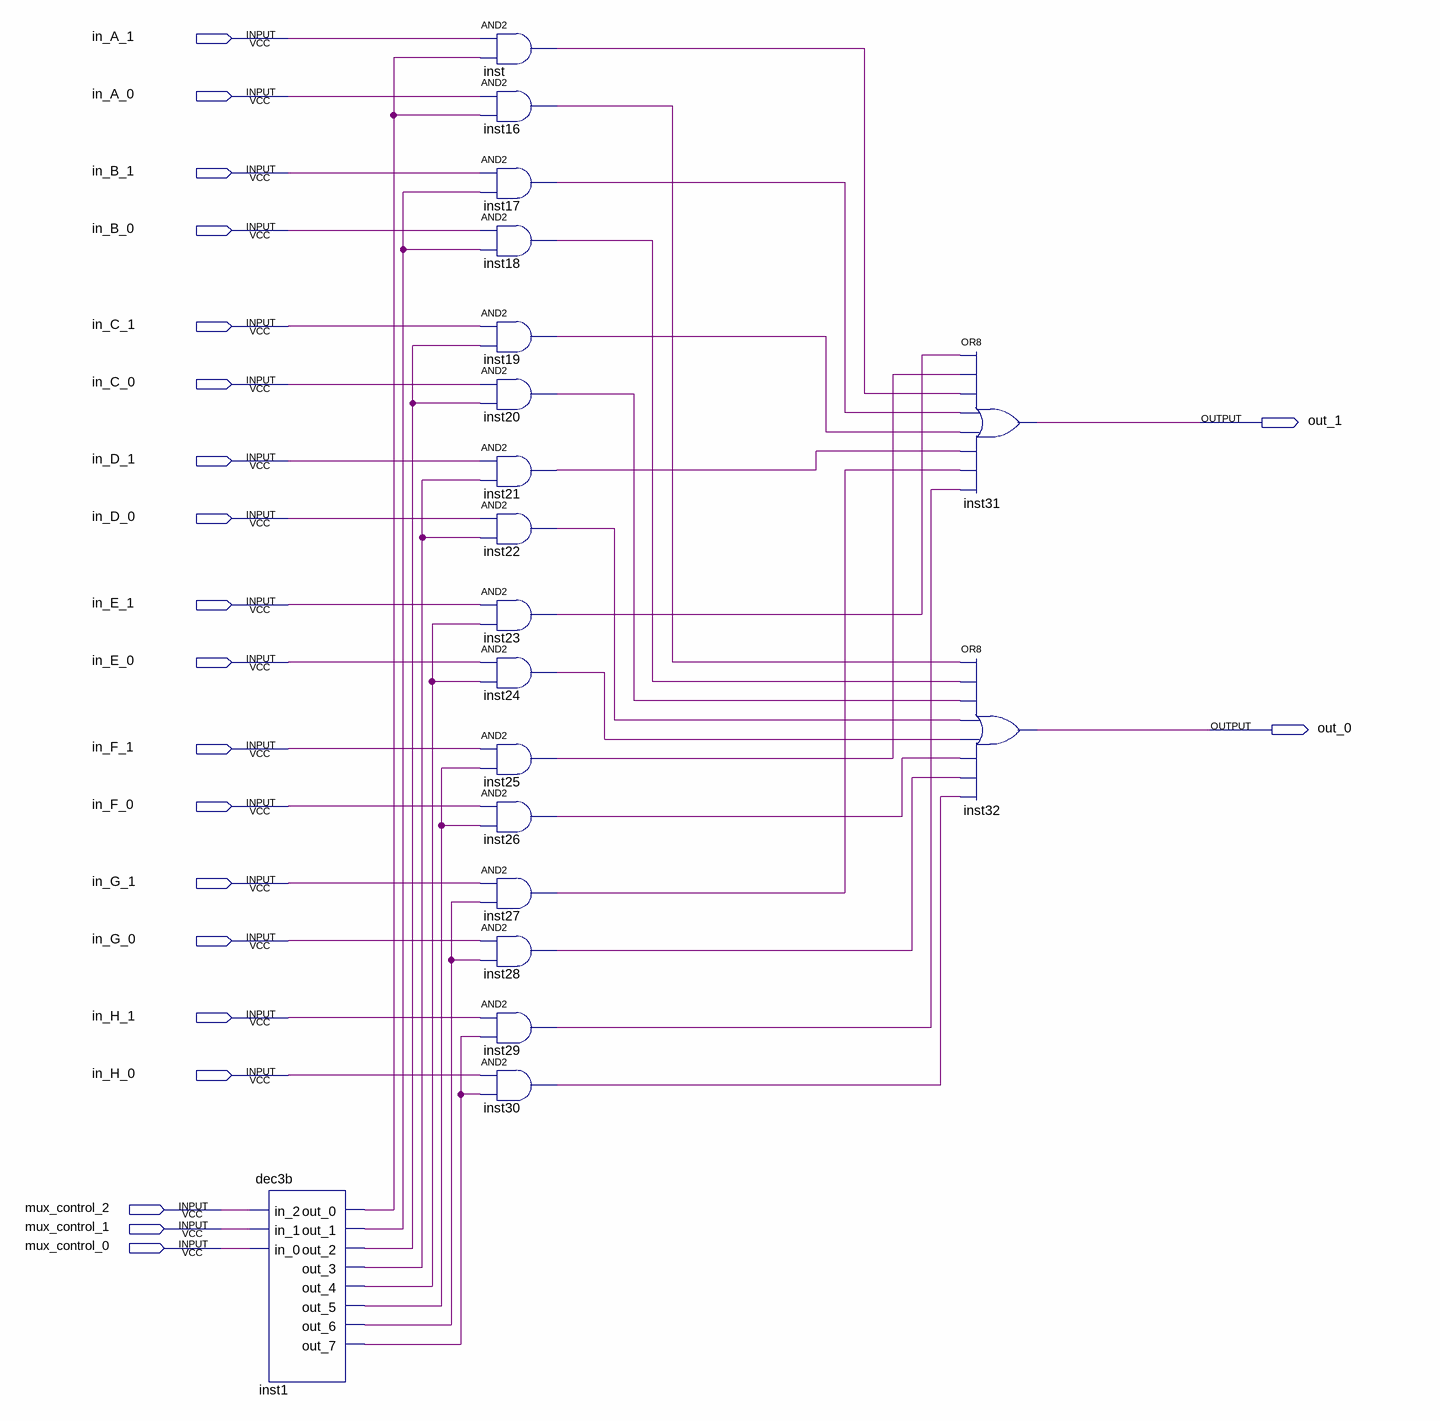
[diagram p0: schematic sheet]
// Quartus schematic mux2b.bdf as structural Verilog: 19 symbols, 21 pins
module mux2b (
  input  in_A_1,
  input  in_A_0,
  input  in_B_1,
  input  in_B_0,
  input  in_C_1,
  input  in_C_0,
  input  in_D_1,
  input  in_D_0,
  input  in_E_1,
  input  in_E_0,
  input  in_F_1,
  input  in_F_0,
  input  in_G_1,
  input  in_G_0,
  input  in_H_1,
  input  in_H_0,
  input  mux_control_2,
  input  mux_control_1,
  input  mux_control_0,
  output out_1,
  output out_0
);

  wire inst1_out_0, inst1_out_1, inst1_out_2, inst1_out_3, inst1_out_4, inst1_out_5, inst1_out_6,
       inst1_out_7, inst16_out, inst17_out, inst18_out, inst19_out, inst20_out, inst21_out, inst22_out,
       inst23_out, inst24_out, inst25_out, inst26_out, inst27_out, inst28_out, inst29_out, inst30_out,
       inst_out;

  dec3b inst1 (
    .in_2(mux_control_2), .in_1(mux_control_1), .in_0(mux_control_0), .out_0(inst1_out_0),
    .out_1(inst1_out_1), .out_2(inst1_out_2), .out_3(inst1_out_3), .out_4(inst1_out_4), .out_5(inst1_out_5),
    .out_6(inst1_out_6), .out_7(inst1_out_7));
  and inst (inst_out, in_A_1, inst1_out_0);
  and inst16 (inst16_out, in_A_0, inst1_out_0);
  and inst17 (inst17_out, in_B_1, inst1_out_1);
  and inst18 (inst18_out, in_B_0, inst1_out_1);
  and inst19 (inst19_out, in_C_1, inst1_out_2);
  and inst20 (inst20_out, in_C_0, inst1_out_2);
  and inst21 (inst21_out, in_D_1, inst1_out_3);
  and inst22 (inst22_out, in_D_0, inst1_out_3);
  and inst23 (inst23_out, in_E_1, inst1_out_4);
  and inst24 (inst24_out, in_E_0, inst1_out_4);
  and inst25 (inst25_out, in_F_1, inst1_out_5);
  and inst26 (inst26_out, in_F_0, inst1_out_5);
  and inst27 (inst27_out, in_G_1, inst1_out_6);
  and inst28 (inst28_out, in_G_0, inst1_out_6);
  and inst29 (inst29_out, in_H_1, inst1_out_7);
  and inst30 (inst30_out, in_H_0, inst1_out_7);
  or inst31 (out_1, inst23_out, inst25_out, inst_out, inst17_out, inst19_out, inst21_out, inst27_out, inst29_out);
  or inst32 (out_0, inst16_out, inst18_out, inst20_out, inst22_out, inst24_out, inst26_out, inst28_out, inst30_out);
endmodule
